# Altium project LMH2121.PrjPcb
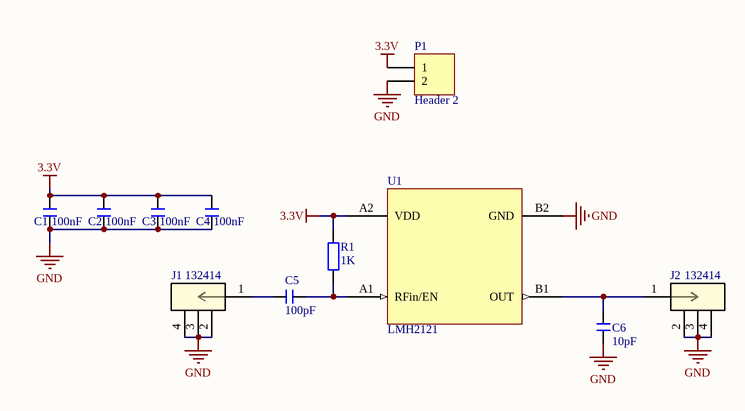
[diagram p0: LMH2121.SchDoc]
1 sheet, 11 parts. Net scope: global (net labels, ports and power ports of the same name join across sheets).
Board file: LMH2121.PcbDoc

## Sheet LMH2121.SchDoc
size A2; SheetNumber: 1; SheetTotal: 1

### Parts
C1  100nF  [C 0402_L]
C2  100nF  [C 0402_L]
C3  100nF  [C 0402_L]
C4  100nF  [C 0402_L]
C5  100pF  [C 0402_L]
C6  10pF  [C 0402_L]
J1  132414  [CONN_132414_AMP]
J2  132414  [CONN_132414_AMP]
P1  Header 2  [HDR1X2]
R1  1K  [R 0402_L]
U1  LMH2121  [BGA4N50P2X2_88X88X50N]

### Nets
3.3V: C1.2 C2.2 C3.2 C4.2 P1.1 R1.2 U1.A2(VDD)
GND: C1.1 C2.1 C3.1 C4.1 C6.1 J1.2 J1.3 J1.4 J2.2 J2.3 J2.4 P1.2 U1.B2(GND)
NetC5_1: C5.1 J1.1
NetC5_2: C5.2 R1.1 U1.A1(RFin/EN)
NetC6_2: C6.2 J2.1 U1.B1(OUT)

### Library data of the parts
C1-C6 = C: 贴片电容; 淘宝ID: 小糖豆的小窝窝; BOM名称: 贴片电容; 下单链接: https://item.taobao.com/item.htm?ft=t&id=613637044352
J1 J2 = 132414: No Description Available; Mfr_Name: Amphenol ICC; Copyright: Copyright (C) 2022 Ultra Librarian. All rights reserved.; Manufacturer_Part_Number: 132414; RefDes: RefDes; Type: DEV
P1 = Header 2: Header, 2-Pin; LatestRevisionDate: 17-Jul-2002; LatestRevisionNote: Re-released for DXP Platform.; Publisher: Altium Limited
R1 = R: 贴片电阻; 淘宝ID: 小糖豆的小窝窝; BOM名称: 贴片电阻; 下单链接: https://item.taobao.com/item.htm?ft=t&id=613637044352
U1 = LMH2121: 3 GHz Fast-Responding Linear Power Detector with 40 dB Dynamic Range